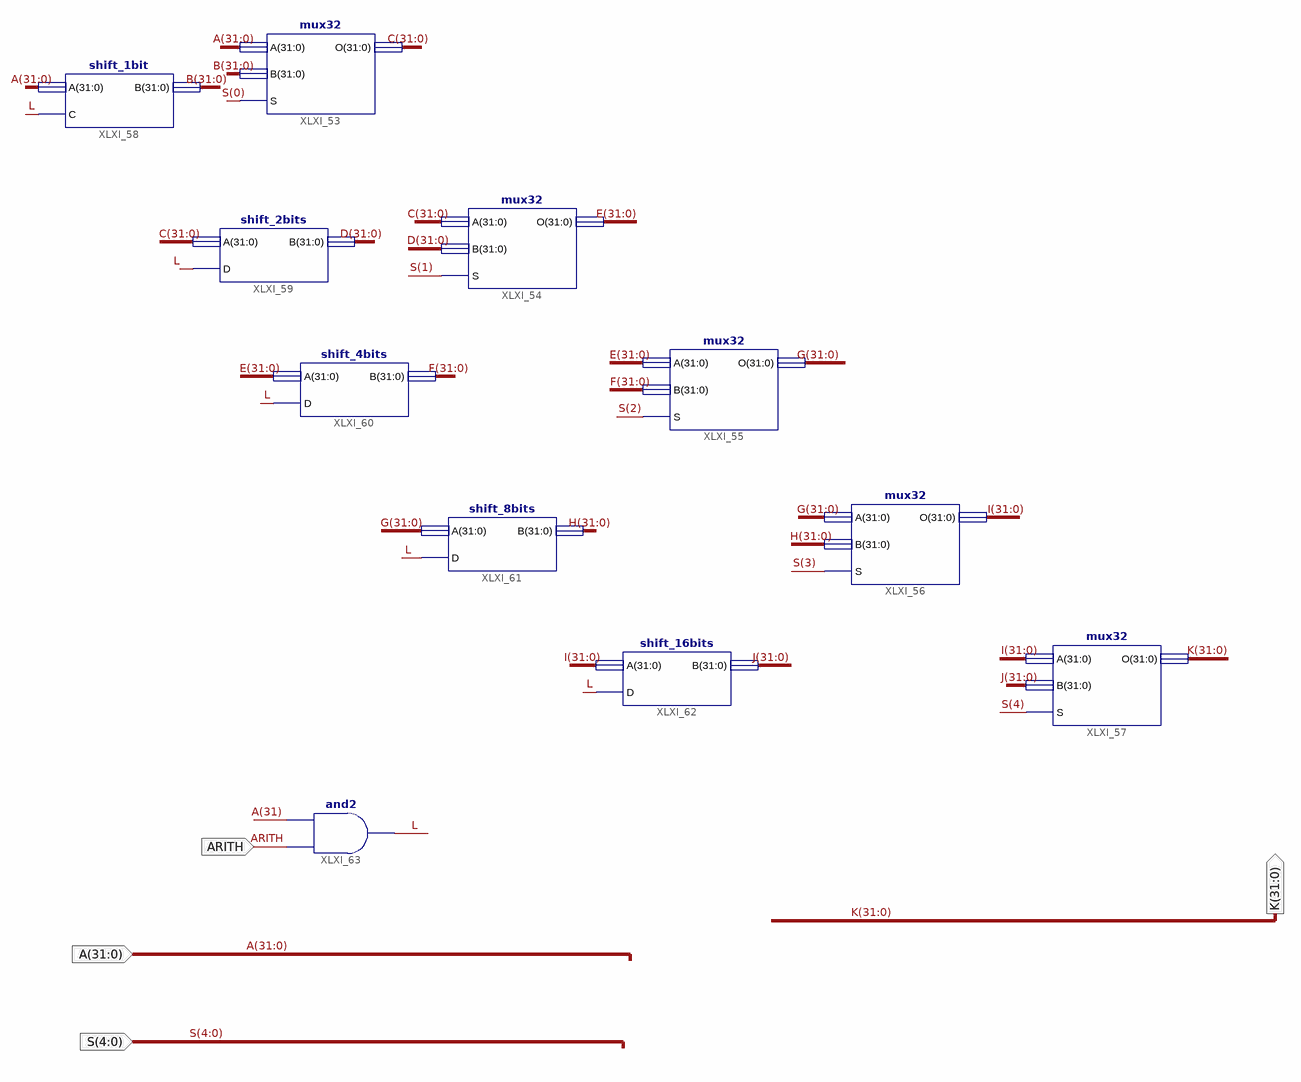
[diagram p0: schematic sheet 1]
// Xilinx ISE schematic shift.sch (artix7) as structural Verilog: 11 symbols, 4 ports
module shift (
  input  [31:0] A,
  input  [4:0] S,
  input  ARITH,
  output [31:0] K
);

  wire L;
  wire [31:0] B, C, D, E, F, G, H, I, J;

  mux32 XLXI_53 (.A(A), .B(B), .S(S[0]), .O(C));
  mux32 XLXI_54 (.A(C), .B(D), .S(S[1]), .O(E));
  mux32 XLXI_55 (.A(E), .B(F), .S(S[2]), .O(G));
  mux32 XLXI_56 (.A(G), .B(H), .S(S[3]), .O(I));
  mux32 XLXI_57 (.A(I), .B(J), .S(S[4]), .O(K));
  shift_1bit XLXI_58 (.A(A), .C(L), .B(B));
  shift_2bits XLXI_59 (.A(C), .D(L), .B(D));
  shift_4bits XLXI_60 (.A(E), .D(L), .B(F));
  shift_8bits XLXI_61 (.A(G), .D(L), .B(H));
  shift_16bits XLXI_62 (.A(I), .D(L), .B(J));
  and XLXI_63 (L, ARITH, A[31]);
endmodule
